# Altium schematic sheet mcu_module.SchDoc
size A4; SheetNumber: 2; SheetTotal: 3
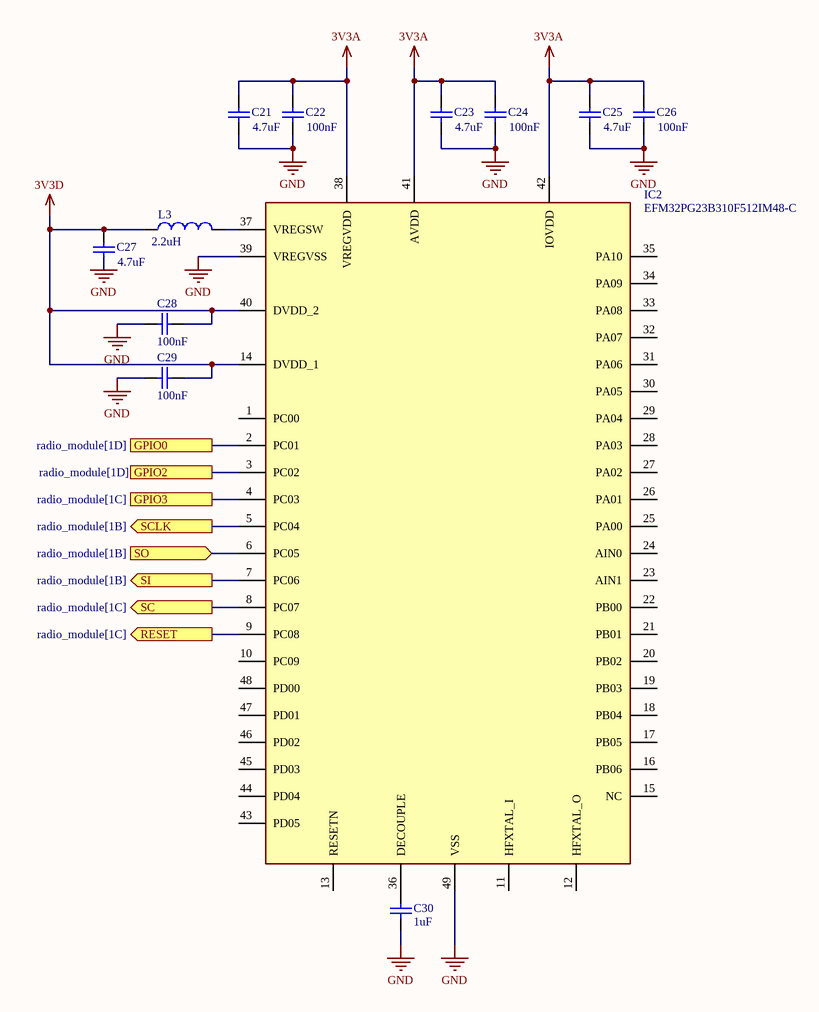
[diagram p0: mcu_module.SchDoc]

## Parts
C21  value 4.7uF  [CAPC1608X92X38LL15T08]  (hidden comment: VJ0603D3R9CXPAJ)
C22  value 100nF  [CAPC1608X92X38LL15T08]  (hidden comment: VJ0603D3R9CXPAJ)
C23  value 4.7uF  [CAPC1608X92X38LL15T08]  (hidden comment: VJ0603D3R9CXPAJ)
C24  value 100nF  [CAPC1608X92X38LL15T08]  (hidden comment: VJ0603D3R9CXPAJ)
C25  value 4.7uF  [CAPC1608X92X38LL15T08]  (hidden comment: VJ0603D3R9CXPAJ)
C26  value 100nF  [CAPC1608X92X38LL15T08]  (hidden comment: VJ0603D3R9CXPAJ)
C27  value 4.7uF  [CAPC1608X92X38LL15T08]  (hidden comment: VJ0603D3R9CXPAJ)
C28  value 100nF  [CAPC1608X92X38LL15T08]  (hidden comment: VJ0603D3R9CXPAJ)
C29  value 100nF  [CAPC1608X92X38LL15T08]  (hidden comment: VJ0603D3R9CXPAJ)
C30  value 1uF  [CAPC1608X92X38LL15T08]  (hidden comment: VJ0603D3R9CXPAJ)
IC2  EFM32PG23B310F512IM48-C  [QFN40P600X600X90-49N-D]
L3  Inductance: 2.2uH  [WE-MK_0603_L1.6W0.8H0.8]  (hidden comment: 7447860115G)

## Ports
GPIO0 (see radio_module[1D]), GPIO2 (see radio_module[1D]), GPIO3 (see radio_module[1C]), RESET (out, see radio_module[1C]), SC (out, see radio_module[1C]), SCLK (out, see radio_module[1B]), SI (out, see radio_module[1B]), SO (in, see radio_module[1B])

## Nets
3V3A: C21.2 C22.2 C23.2 C24.2 C25.2 C26.2 IC2.38(VREGVDD) IC2.41(AVDD) IC2.42(IOVDD)
3V3D: C27.2 C28.1 C29.1 IC2.14(DVDD_1) IC2.40(DVDD_2) L3.1
GND: C21.1 C22.1 C23.1 C24.1 C25.1 C26.1 C27.1 C28.2 C29.2 C30.2 IC2.39(VREGVSS) IC2.49(VSS)
GPIO0: IC2.2(PC01) ; port GPIO0
GPIO2: IC2.3(PC02) ; port GPIO2
GPIO3: IC2.4(PC03) ; port GPIO3
RESET: IC2.9(PC08) ; port RESET
SC: IC2.8(PC07) ; port SC
SCLK: IC2.5(PC04) ; port SCLK
SI: IC2.7(PC06) ; port SI
SO: IC2.6(PC05) ; port SO
NetC30_1: C30.1 IC2.36(DECOUPLE)
NetIC2_37: IC2.37(VREGSW) L3.2

Not connected (* = marked no-connect by the designer): IC2 1(PC00) 10(PC09) 11(HFXTAL_I) 12(HFXTAL_O) 13(RESETN) 15(NC) 16(PB06) 17(PB05) 18(PB04) 19(PB03) 20(PB02) 21(PB01) 22(PB00) 23(AIN1) 24(AIN0) 25(PA00) 26(PA01) 27(PA02) 28(PA03) 29(PA04) 30(PA05) 31(PA06) 32(PA07) 33(PA08) 34(PA09) 35(PA10) 43(PD05) 44(PD04) 45(PD03) 46(PD02) 47(PD01) 48(PD00)

## Library data of the parts
C21-C30 = CMP-2006-01519-1: Manufacturer: Vitramon; Part Number: VJ0603D3R9CXPAJ
IC2 = EFM32PG23B310F512IM48-C: Integrated Circuit; Manufacturer_Name: Silicon Labs; Datasheet Link: https://www.mouser.com/datasheet/2/368/efm32pg23_datasheet-2952668.pdf; Height: 0.9mm; Manufacturer_Part_Number: EFM32PG23B310F512IM48-C; Mouser Part Number: 634-PG23310F512IM48C; Mouser Price/Stock: https://www.mouser.co.uk/ProductDetail/Silicon-Labs/EFM32PG23B310F512IM48-C?qs=t7xnP681wgVHLxdeoMvbtg%3D%3D; Arrow Part Number: EFM32PG23B310F512IM48-C; Arrow Price/Stock: https://www.arrow.com/en/products/efm32pg23b310f512im48-c/silicon-labs?region=nac
L3 = CMP-03913-120013800-1: Current Rating: 550mA; Length: 1.6mm; NexarPartId: 120013800; Height: 800µm; RoHS: Compliant; Max Operating Temperature: 125°C; Ambient Temperature Range Low: -55°C; Width: 800µm; Ambient Temperature Range High: 105°C; Min Operating Temperature: -55°C